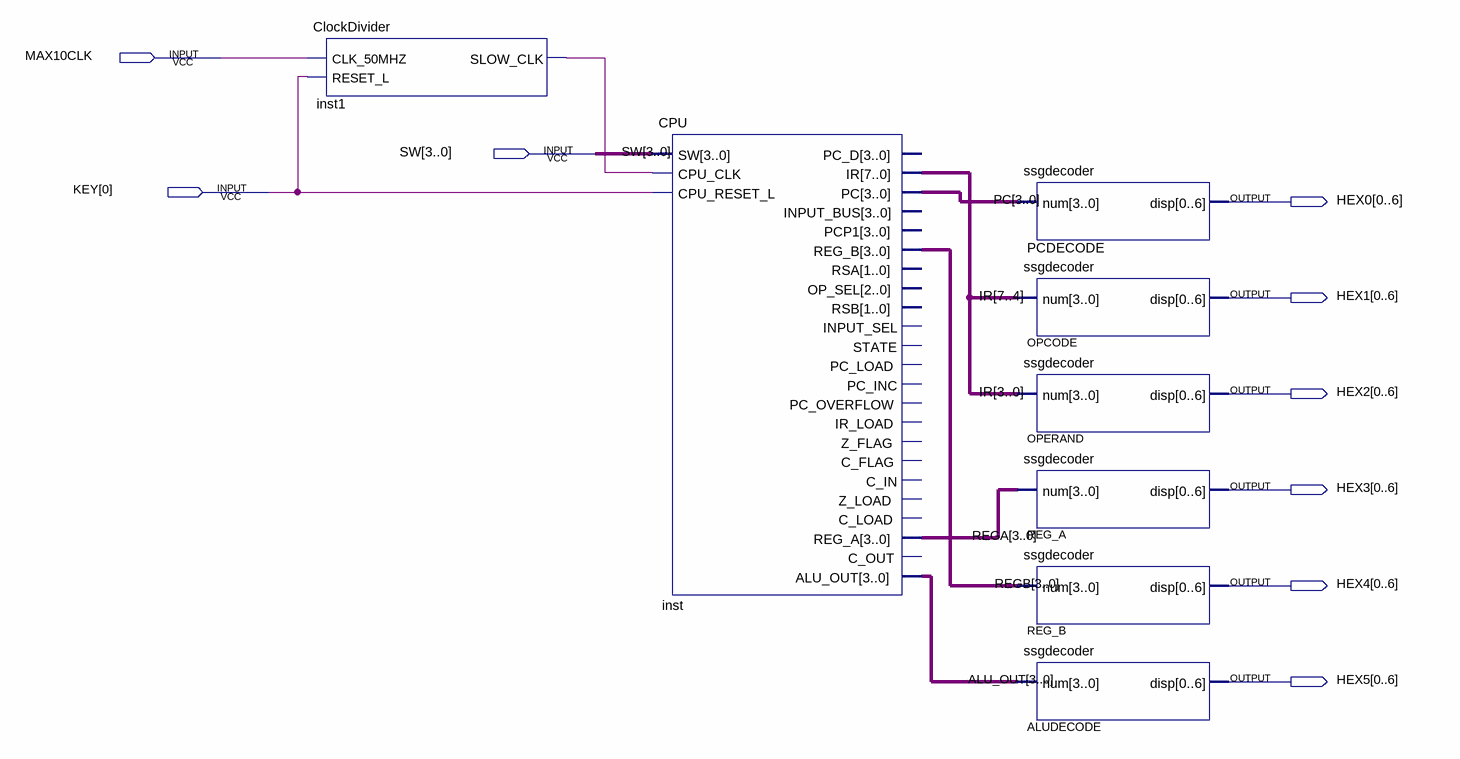
[diagram p0: schematic sheet]
// Quartus schematic DE10_TOP - Copy.bdf as structural Verilog: 8 symbols, 9 pins
module \DE10_TOP_-_Copy  (
  input  MAX10CLK,
  input  [3:0] SW,
  input  [0:0] KEY,
  output [0:6] HEX0,
  output [0:6] HEX1,
  output [0:6] HEX2,
  output [0:6] HEX3,
  output [0:6] HEX4,
  output [0:6] HEX5
);

  wire inst1_slow_clk;
  wire [3:0] ALU_OUT, PC, REGA, REGB;
  wire [7:0] IR;

  ClockDivider inst1 (.CLK_50MHZ(MAX10CLK), .RESET_L(KEY[0]), .SLOW_CLK(inst1_slow_clk));
  CPU inst (
    .SW(SW), .CPU_CLK(inst1_slow_clk), .CPU_RESET_L(KEY[0]), .IR(IR), .PC(PC), .REG_B(REGB), .REG_A(REGA),
    .ALU_OUT(ALU_OUT));  // open: PC_D, INPUT_BUS, PCP1, RSA, OP_SEL, RSB, INPUT_SEL, STATE, PC_LOAD, PC_INC, PC_OVERFLOW, IR_LOAD, Z_FLAG, C_FLAG, C_IN, Z_LOAD, C_LOAD, C_OUT
  ssgdecoder PCDECODE (.num(PC), .disp(HEX0));
  ssgdecoder OPCODE (.num(IR[7:4]), .disp(HEX1));
  ssgdecoder OPERAND (.num(IR[3:0]), .disp(HEX2));
  ssgdecoder REG_A (.num(REGA), .disp(HEX3));
  ssgdecoder REG_B (.num(REGB), .disp(HEX4));
  ssgdecoder ALUDECODE (.num(ALU_OUT), .disp(HEX5));
endmodule
